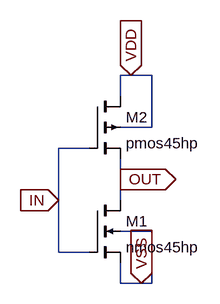
[diagram p0: schematic INV128.asc]
INV128.asc, the LTspice schematic file:
Version 4.1
SHEET 1 1048 680
WIRE 224 -16 208 -16
WIRE 256 -16 224 -16
WIRE 208 16 208 -16
WIRE 256 64 256 -16
WIRE 256 64 208 64
WIRE 160 96 112 96
WIRE 208 144 208 112
WIRE 112 176 112 96
WIRE 208 176 208 144
WIRE 256 224 208 224
WIRE 112 256 112 176
WIRE 160 256 112 256
WIRE 208 304 208 272
WIRE 240 304 208 304
WIRE 256 304 256 224
WIRE 256 304 240 304
FLAG 112 176 IN
IOPIN 112 176 In
FLAG 208 144 OUT
IOPIN 208 144 Out
FLAG 224 -16 VDD
IOPIN 224 -16 In
FLAG 240 304 VSS
IOPIN 240 304 In
SYMBOL nmos4 160 176 R0
SYMATTR InstName M1
SYMATTR Value nmos45hp
SYMATTR Value2 l=100n w=25.6u
SYMBOL pmos4 160 16 R0
SYMATTR InstName M2
SYMATTR Value pmos45hp
SYMATTR Value2 l=100n w=38.4u

The netlist it stands for:
* INV128.asc
M1 OUT IN VSS VSS nmos45hp l=100n w=25.6u
M2 VDD IN OUT VDD pmos45hp l=100n w=38.4u
.model NMOS NMOS
.model PMOS PMOS
.lib standard.mos
.backanno
.end